# Altium schematic sheet WT108_Output.schdoc
size A4
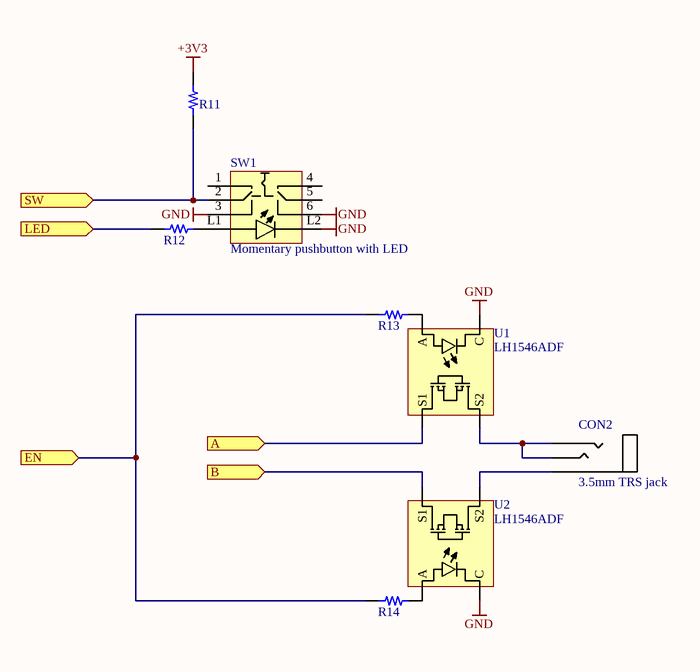
[diagram p0: WT108_Output.schdoc]

## Parts
CON2  3.5mm TRS jack  [3.5mm socket, side mount]
R11  10 kOhms  [RES 0603_1608]  (value not drawn)
R12  120 Ohms  [RES 0603_1608]  (value not drawn)
R13  120 Ohms  [RES 0603_1608]  (value not drawn)
R14  120 Ohms  [RES 0603_1608]  (value not drawn)
SW1  Momentary pushbutton with LED  [Switch_with_LED]
U1  LH1546ADF  [LH1546]
U2  LH1546ADF  [LH1546]

## Ports
A (in), B (in), EN (in), LED (in), SW (in)

## Nets
+3V3: R11.2
GND: SW1.3 SW1.6 SW1.L2(C) U1.2(C) U2.2(C)
A: U1.4(S1) ; port A
B: U2.4(S1) ; port B
EN: R13.1 R14.1 ; port EN
LED: R12.1 ; port LED
SW: R11.1 SW1.2 ; port SW
NetCON2_R: CON2.R CON2.T U1.3(S2)
NetCON2_S: CON2.S U2.3(S2)
NetR12_2: R12.2 SW1.L1(A)
NetR13_2: R13.2 U1.1(A)
NetR14_2: R14.2 U2.1(A)

Not connected (* = marked no-connect by the designer): SW1 1(7) 4 5

## Notes on the sheet
- Title
- Size:
- Project:
- A4
- Date:
- Revision:
- Sheet
- of
- Wendy
- Teslaburger
- File:

## Library data of the parts
R11 = RT0603DRD0710KL: RES SMD 10K OHM 0.5% 1/10W 0603; Manufacturer: Yageo; Power (Watts): 0.1W, 1/10W; Temperature Coefficient: ±25ppm/°C; ComponentLink1Description: Datasheet; ComponentLink1URL: https://www.yageo.com/upload/media/product/productsearch/datasheet/rchip/PYu-RT_1-to-0.01_RoHS_L_11.pdf; ComponentLink2Description: DigiKey Link; ComponentLink2URL: http://digikey.com/product-detail/en/yageo/RT0603DRD0710KL/311-10KDCT-ND/1035680; Composition: Thin Film; Device Package: 0603 (1608 Metric); Height - Seated (Max): 0.022" (0.55mm); LastUpdated: 02/09/2020 01:10:23; Lifecycle Status: Active; Part Number: RT0603DRD0710KL; Minimum Order: 1; Number of Terminations: 2; Operating Temperature: -55°C ~ 155°C; Package / Case: 0603 (1608 Metric); Packaging: TapeAndReel; PartId: 5487; Part Status: Active; Price: 0.02; Resistance: 10 kOhms; Series: RT; Size / Dimension: 0.063" L x 0.031" W (1.60mm x 0.80mm); Supplier 1: DigiKey; Supplier Part Number 1: 311-10KDCT-ND; Supplier Device Package: 0603; Tolerance: ±0.5%; Value: 10 kOhms
R12-R14 = RT0603DRE07120RL: RES SMD 120 OHM 0.5% 1/10W 0603; Manufacturer: Yageo; Power (Watts): 0.1W, 1/10W; Temperature Coefficient: ±50ppm/°C; ComponentLink1Description: Datasheet; ComponentLink1URL: https://www.yageo.com/upload/media/product/productsearch/datasheet/rchip/PYu-RT_1-to-0.01_RoHS_L_11.pdf; ComponentLink2Description: DigiKey Link; ComponentLink2URL: http://digikey.com/product-detail/en/yageo/RT0603DRE07120RL/311-2409-1-ND/6128828; Composition: Thin Film; Device Package: 0603 (1608 Metric); Height - Seated (Max): 0.022" (0.55mm); LastUpdated: 02/09/2020 01:10:15; Lifecycle Status: Active; Part Number: RT0603DRE07120RL; Minimum Order: 1; Number of Terminations: 2; Operating Temperature: -55°C ~ 155°C; Package / Case: 0603 (1608 Metric); Packaging: TapeAndReel; PartId: 9567; Part Status: Active; Price: 0.01; Resistance: 120 Ohms; Series: RT; Size / Dimension: 0.063" L x 0.031" W (1.60mm x 0.80mm); Supplier 1: DigiKey; Supplier Part Number 1: 311-2409-1-ND; Supplier Device Package: 0603; Tolerance: ±0.5%; Value: 120 Ohms
SW1 = MCPSD7x
U1 U2 = LH1546ADF: 1 Form A Solid-State Relay (Normally Open) 22Ohm 350V